# Altium schematic sheet MMA8452QT.SchDoc: Evaluation Board MMA8452QT
size A4; Date: 07/12/2016; CheckedBy: Nicolas LAW; Author: Nicolas LAW; DrawnBy: Nicolas LAW; Engineer: Nicolas LAW; Revision: 1; SheetNumber: 1; SheetTotal: 1; DocumentName: Evaluation Board MMA8452QT; ProjectName: Knocklet
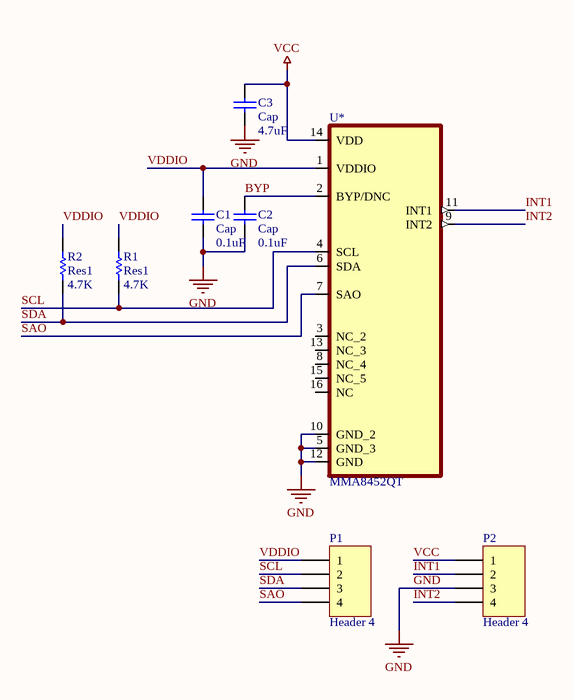
[diagram p0: MMA8452QT.SchDoc]

## Parts
C1  Cap  value 0.1uF  [RAD-0.3]
C2  Cap  value 0.1uF  [RAD-0.3]
C3  Cap  value 4.7uF  [RAD-0.3]
P1  Header 4  [HDR1X4]
P2  Header 4  [HDR1X4]
R1  Res1  value 4.7K  [AXIAL-0.3]
R2  Res1  value 4.7K  [AXIAL-0.3]
U*  MMA8452QT  [MMA8452QT]

## Nets
GND: C1.1 C2.1 C3.1 P2.3 U*.5(GND_3) U*.10(GND_2) U*.12(GND)
VCC: C3.2 P2.1 U*.14(VDD)
BYP: C2.2 U*.2(BYP/DNC)
INT1: P2.2 U*.11(INT1)
INT2: P2.4 U*.9(INT2)
SAO: P1.4 U*.7(SAO)
SCL: P1.2 R1.1 U*.4(SCL)
SDA: P1.3 R2.1 U*.6(SDA)
VDDIO: C1.2 P1.1 R1.2 R2.2 U*.1(VDDIO)

Not connected (* = marked no-connect by the designer): U* 3(NC_2) 8(NC_4) 13(NC_3) 15(NC_5) 16(NC)

## Notes on the sheet
- Title
- Size:
- Date:
- A4
- Number:
- Time:
- Revision:
- Sheet
- of
- File:

## Library data of the parts
C1-C3 = Cap: Capacitor; Published: 8-Jun-2000; LatestRevisionDate: 17-Jul-2002; LatestRevisionNote: Re-released for DXP Platform.; PackageReference: RAD-0.3; Publisher: Altium Limited; PackageDescription: Radial Cap, Thru-Hole; 2 Leads; 0.3 in Pin Spacing
P1 P2 = Header 4: Header, 4-Pin; LatestRevisionDate: 17-Jul-2002; LatestRevisionNote: Re-released for DXP Platform.; Publisher: Altium Limited
R1 R2 = Res1: Resistor; Published: 8-Jun-2000; LatestRevisionDate: 17-Jul-2002; LatestRevisionNote: Re-released for DXP Platform.; PackageReference: AXIAL-0.3; Publisher: Altium Limited; PackageDescription: Axial Device, Thru-Hole; 2 Leads; 0.3 in Pin Spacing